# Altium schematic sheet X-Track_Power.SchDoc
size A4
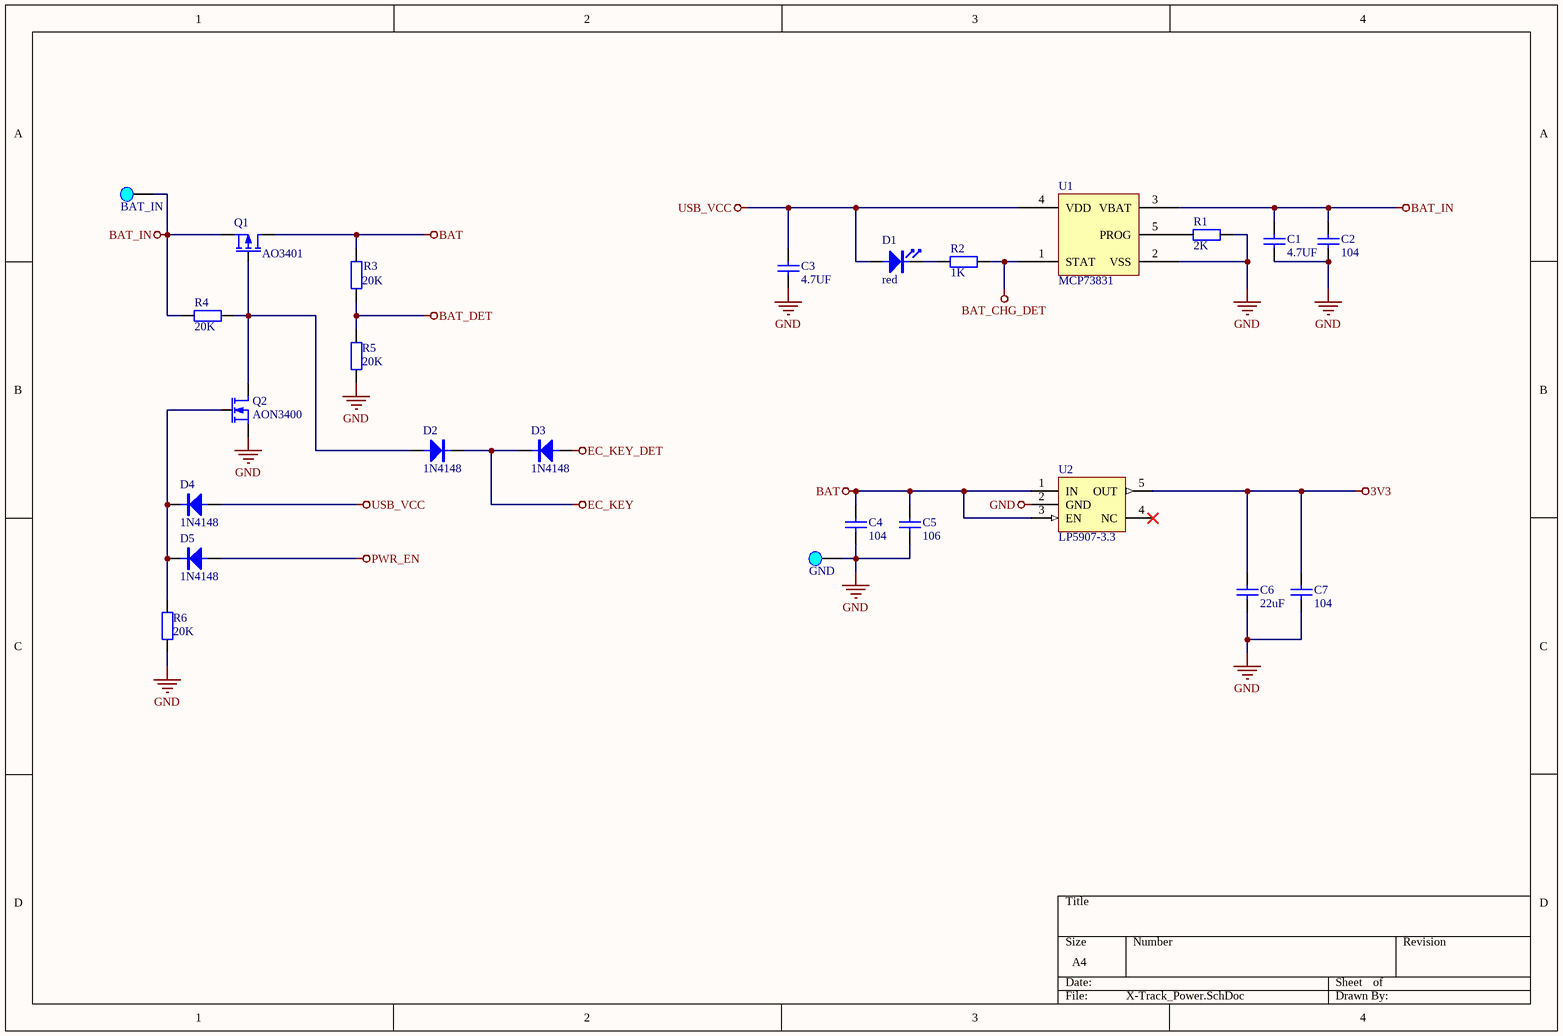
[diagram p0: X-Track_Power.SchDoc]

## Parts
BAT+  BAT_IN  [Pad_B]
BAT-  GND  [Pad_B]
C1  4.7UF  [电容_C0805]
C2  104  [电容_C0603]
C3  4.7UF  [电容_C0805]
C4  104  [电容_C0603]
C5  106  [电容_C0603]
C6  22uF  [电容_C1206]
C7  104  [电容_C0603]
D1  red  [LED_0603]
D2  1N4148  [二极管_SOD-323]
D3  1N4148  [二极管_SOD-323]
D4  1N4148  [二极管_SOD-323]
D5  1N4148  [二极管_SOD-323]
Q1  AO3401  [MOS_SOT-23]
Q2  AON3400  [MOS_SOT-23]
R1  2K  [电阻_R0603]
R2  1K  [电阻_R0603]
R3  20K  [电阻_R0603]
R4  20K  [电阻_R0603]
R5  20K  [电阻_R0603]
R6  20K  [电阻_R0603]
U1  MCP73831  [SOT23-5]
U2  LP5907-3.3  [SOT23-5]

## Nets
3V3: C6.2 C7.2 U2.5(OUT)
BAT: C4.2 C5.2 Q1.2(D) R3.2 U2.1(IN) U2.3(EN)
BAT_CHG_DET: R2.1 U1.1(STAT)
BAT_DET: R3.1 R5.2
BAT_IN: BAT+.1 C1.2 C2.1 Q1.3(S) R4.1 U1.3(VBAT)
EC_KEY: D2.K D3.K
EC_KEY_DET: D3.A
GND: BAT-.1 C1.1 C2.2 C3.1 C4.1 C5.1 C6.1 C7.1 Q2.3(S) R1.1 R5.1 R6.2 U1.2(VSS) U2.2(GND)
PWR_EN: D5.A
USB_VCC: C3.2 D1.A D4.A U1.4(VDD)
NetD1_K: D1.K R2.2
NetD2_A: D2.A Q1.1(G) Q2.2(D) R4.2
NetD4_K: D4.K D5.K Q2.1(G) R6.1
NetR1_2: R1.2 U1.5(PROG)

Not connected (* = marked no-connect by the designer): U2 4(NC)*

## Library data of the parts
BAT+ = Pad: _Funcyusa: Test; _Specification: Pad,Test,BAT_IN; _Comma: ,; _Name: Pad; _Remarks: BAT_IN
BAT- = Pad: _Funcyusa: Test; _Specification: Pad,Test,GND; _Comma: ,; _Name: Pad; _Remarks: GND
C1-C7 = cap: U: 50V; 参数: Cap,0805,X7R,104K,50V,125C,±10%
  C1 C3: C: 4.7UF
  C2 C4 C7: C: 104
  C5: C: 106
  C6: C: 22uF
D1 = LED: 参数: LED,0603,Red
D2-D5 = Diode: _Specification: Diode,1N4148,SOD-323,1A,40V; _Comma: ,; _Footprint: SOD-323; _Voltage: 40V; _Current: 1A; _Name: Diode; _Model: 1N4148
Q1 = MOSFET-P: _Comma: ,; _Current: 40A; _Footprint: DFN3.3*3.3; _Name: P-MOSFET; _Specification: P-MOSFET,AO3401,DFN3.3*3.3,40A,20V; _Voltage: 20V; _Model: AO3401
Q2 = MOSFET-N: _Comma: ,; _Current: 150A; _Footprint: DFN5*6; _Name: N-MOSFET; _Specification: N-MOSFET,AON3400,DFN5*6,150A,30V; _Voltage: 30V; _Model: AON3400
R1-R6 = Res: P: 1/8W; 参数: Res,0805,0R,±1%,1/8W,100ppm,155C
  R1: R: 2K
  R2: R: 1K
  R3-R6: R: 20K
U1 = MCP73831: 线性充电管理控制器
U2 = LP5907: LDO